# EasyEDA schematic schematic.json
TITLE: Sheet_1; REV: 1.0; Date: 2024-12-31; Sheet: 1/1; Drawn By: nguyenmax2008; Company: Your Company
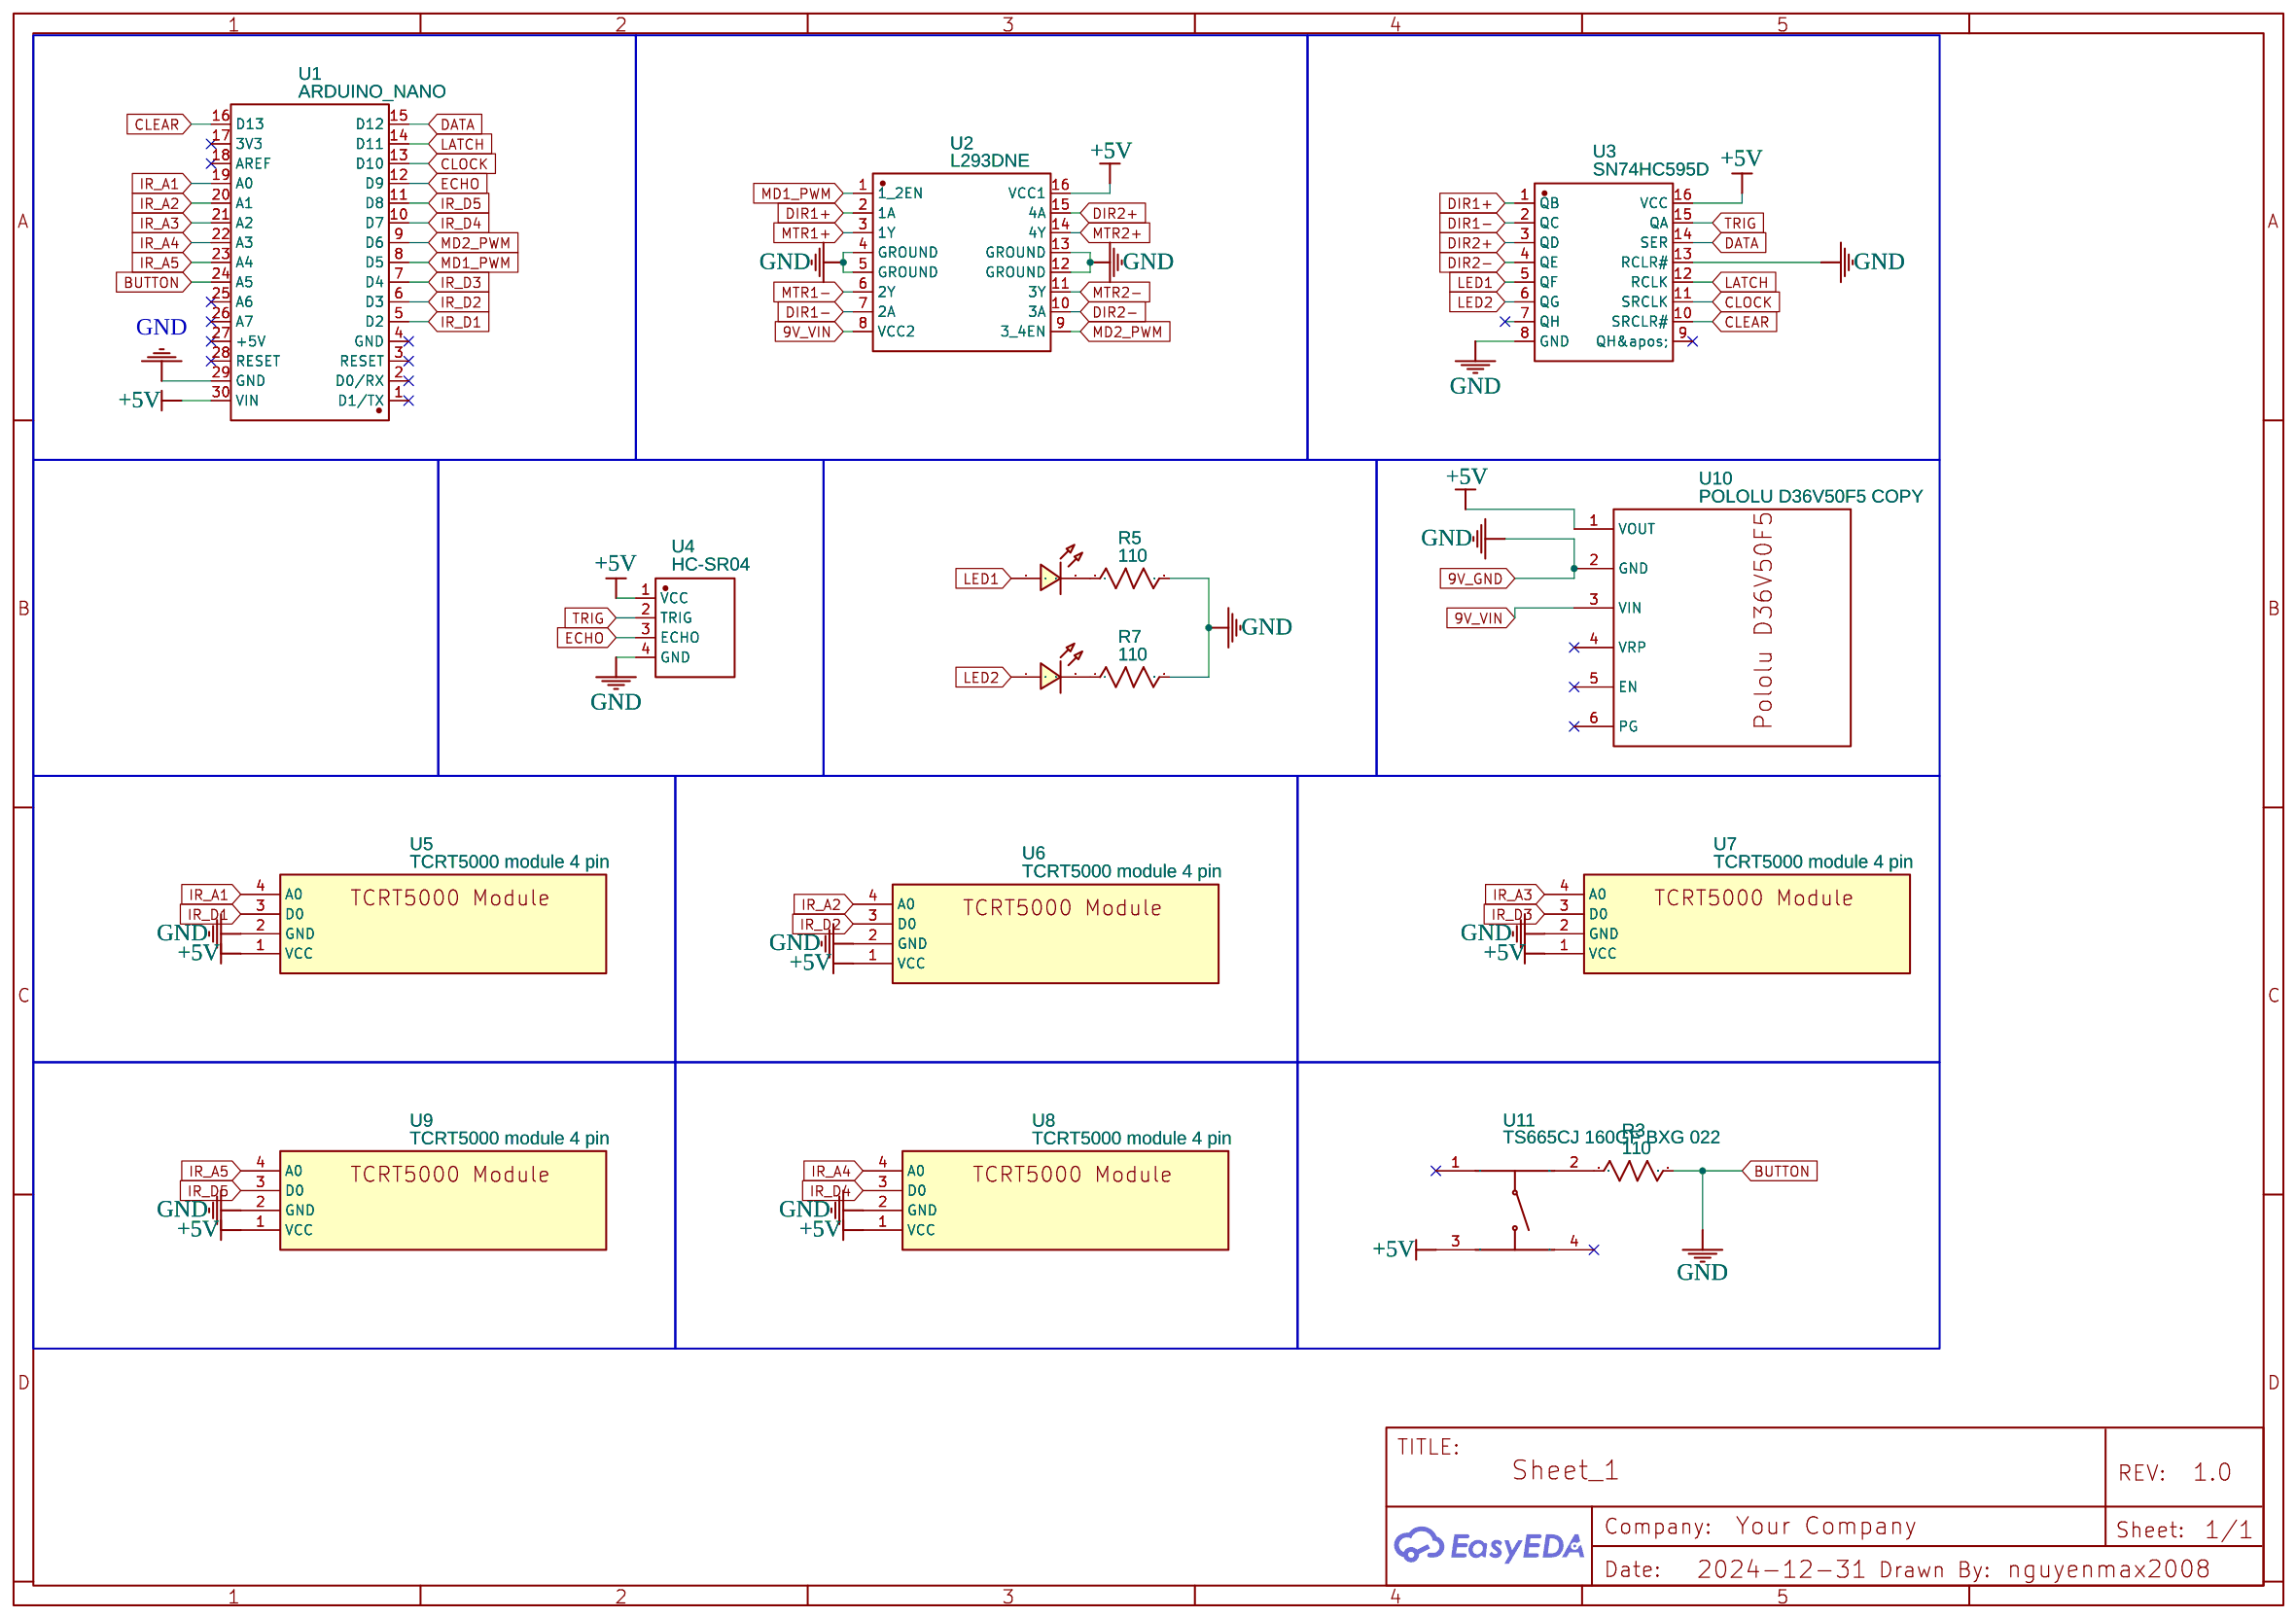
[diagram p0: schematic sheet]

## Parts
LED6  LED-TH-3mm_R  [LED-TH_BD3.0_RED]
LED9  LED-TH-3mm_B  [LED-TH_BD3.0_BLUE]
R3  110  [R_AXIAL-0.3]
R5  110  [R_AXIAL-0.3]
R7  110  [R_AXIAL-0.3]
U1  ARDUINO_NANO  [COMM-TH_ARDUINO_NANO]
U2  L293DNE  [DIP-16_L20.0-W6.4-P2.54-LS7.6-BL]
U3  SN74HC595D  [DIP-16_L19.8-W6.5-P2.54-LS7.6-BL]
U4  HC-SR04  [TH_HC-SR04V]
U5  TCRT5000 module 4 pin  [TCRT5000 SOLDER]
U6  TCRT5000 module 4 pin  [TCRT5000 SOLDER]
U7  TCRT5000 module 4 pin  [TCRT5000 SOLDER]
U8  TCRT5000 module 4 pin  [TCRT5000 SOLDER]
U9  TCRT5000 module 4 pin  [TCRT5000 SOLDER]
U10  POLOLU D36V50F5 COPY  [POLOLU D36V50F5 - EDIT]
U11  TS665CJ 160GF BXG 022  [SW-TH_4P-L6.0-W6.0-P4.50-LS6.5]

## Library data of the parts
LED6 = LED-TH-3mm_R: Manufacturer: EVERLIGHT(台湾亿光); Manufacturer Part: 204-10SDRD/S530-A3-L; Supplier Part: C84774; Supplier: LCSC; Contributor: LCEDA_Lib
LED9 = LED-TH-3mm_B: Manufacturer: EVERLIGHT(台湾亿光); Manufacturer Part: 204-10SUBC/S400-A4; Supplier Part: C86881; Supplier: LCSC; Contributor: LCEDA_Lib
R3 R5 R7 = R_AXIAL-0.3_US: Contributor: LCEDA_Lib
U1 = ARDUINO_NANO: Contributor: lcsc; Supplier: LCSC; Supplier Part: C9900017879; Manufacturer: null; JLCPCB Part Class: Extended Part
U2 = L293DNE: Contributor: LCSC; Supplier: LCSC; Supplier Part: C701118; Manufacturer: TI(德州仪器); JLCPCB Part Class: Extended Part
U3 = SN74HC595D: Supplier: LCSC; Supplier Part: C354411; Manufacturer: null; Contributor: lcsc
U4 = HC-SR04: Supplier: LCSC; Supplier Part: C19857336; Manufacturer: Universal Microelectronics; Contributor: lcsc; JLCPCB Part Class: Extended Part
U5-U9 = TCRT5000 module 4 pin: Contributor: bespired; sourceId: YsmgyP7pj
U10 = POLOLU D36V50F5 COPY: Contributor: alexanderhauschild10
U11 = TS665CJ 160GF BXG 022: Contributor: lcsc; Supplier: LCSC; Supplier Part: C5369132; Manufacturer: SHOU HAN(首韩); Manufacturer Part: TS665CJ 160gf BXG 022; JLCPCB Part Class: Extended Part

## Nets
9V_GND: R3.2 R5.2 R7.2 U1.24(A5) U1.29(GND) U2.4(GROUND) U2.5(GROUND) U2.12(GROUND) U2.13(GROUND) U3.8(GND) U3.13(RCLR#) U4.4(GND) U5.2(GND) U6.2(GND) U7.2(GND) U8.2(GND) U9.2(GND) U10.2(GND)
9V_VIN: U2.8(VCC2) U10.3(VIN)
+5V: U1.30(VIN) U2.16(VCC1) U3.16(VCC) U4.1(VCC) U5.1(VCC) U6.1(VCC) U7.1(VCC) U8.1(VCC) U9.1(VCC) U10.1(VOUT) U11.3(C)
CLEAR: U1.16(D13) U3.10(SRCLR#)
CLOCK: U1.13(D10) U3.11(SRCLK)
DATA: U1.15(D12) U3.14(SER)
DIR1+: U2.2(1A) U3.1(QB)
DIR1-: U2.7(2A) U3.2(QC)
DIR2+: U2.15(4A) U3.3(QD)
DIR2-: U2.10(3A) U3.4(QE)
ECHO: U1.12(D9) U4.3(ECHO)
IR_A1: U1.19(A0) U5.4(A0)
IR_A2: U1.20(A1) U6.4(A0)
IR_A3: U1.21(A2) U7.4(A0)
IR_A4: U1.22(A3) U8.4(A0)
IR_A5: U1.23(A4) U9.4(A0)
IR_D1: U1.5(D2) U5.3(D0)
IR_D2: U1.6(D3) U6.3(D0)
IR_D3: U1.7(D4) U7.3(D0)
IR_D4: U1.10(D7) U8.3(D0)
IR_D5: U1.11(D8) U9.3(D0)
LATCH: U1.14(D11) U3.12(RCLK)
LED1: LED6.1 U3.5(QF)
LED2: LED9.1 U3.6(QG)
MD1_PWM: U1.8(D5) U2.1(1_2EN)
MD2_PWM: U1.9(D6) U2.9(3_4EN)
MTR1+: U2.3(1Y)
MTR1-: U2.6(2Y)
MTR2+: U2.14(4Y)
MTR2-: U2.11(3Y)
TRIG: U3.15(QA) U4.2(TRIG)
Net-(LED6-2): LED6.2 R5.1
Net-(LED9-2): LED9.2 R7.1
Net-(R3-1): R3.1 U11.2(B)

Not connected (* = marked no-connect by the designer): U1 1(D1/TX)* 2(D0/RX)* 3(RESET)* 4(GND)* 17(3V3)* 18(AREF)* 25(A6)* 26(A7)* 27(+5V)* 28(RESET)*; U3 7(QH) 9(QH')*; U10 4(VRP)* 5(EN)* 6(PG)*; U11 1(A)* 4(D)*
